# EAGLE board RP2040_MainV1_alternateLayout (EAGLE 9.6.2)
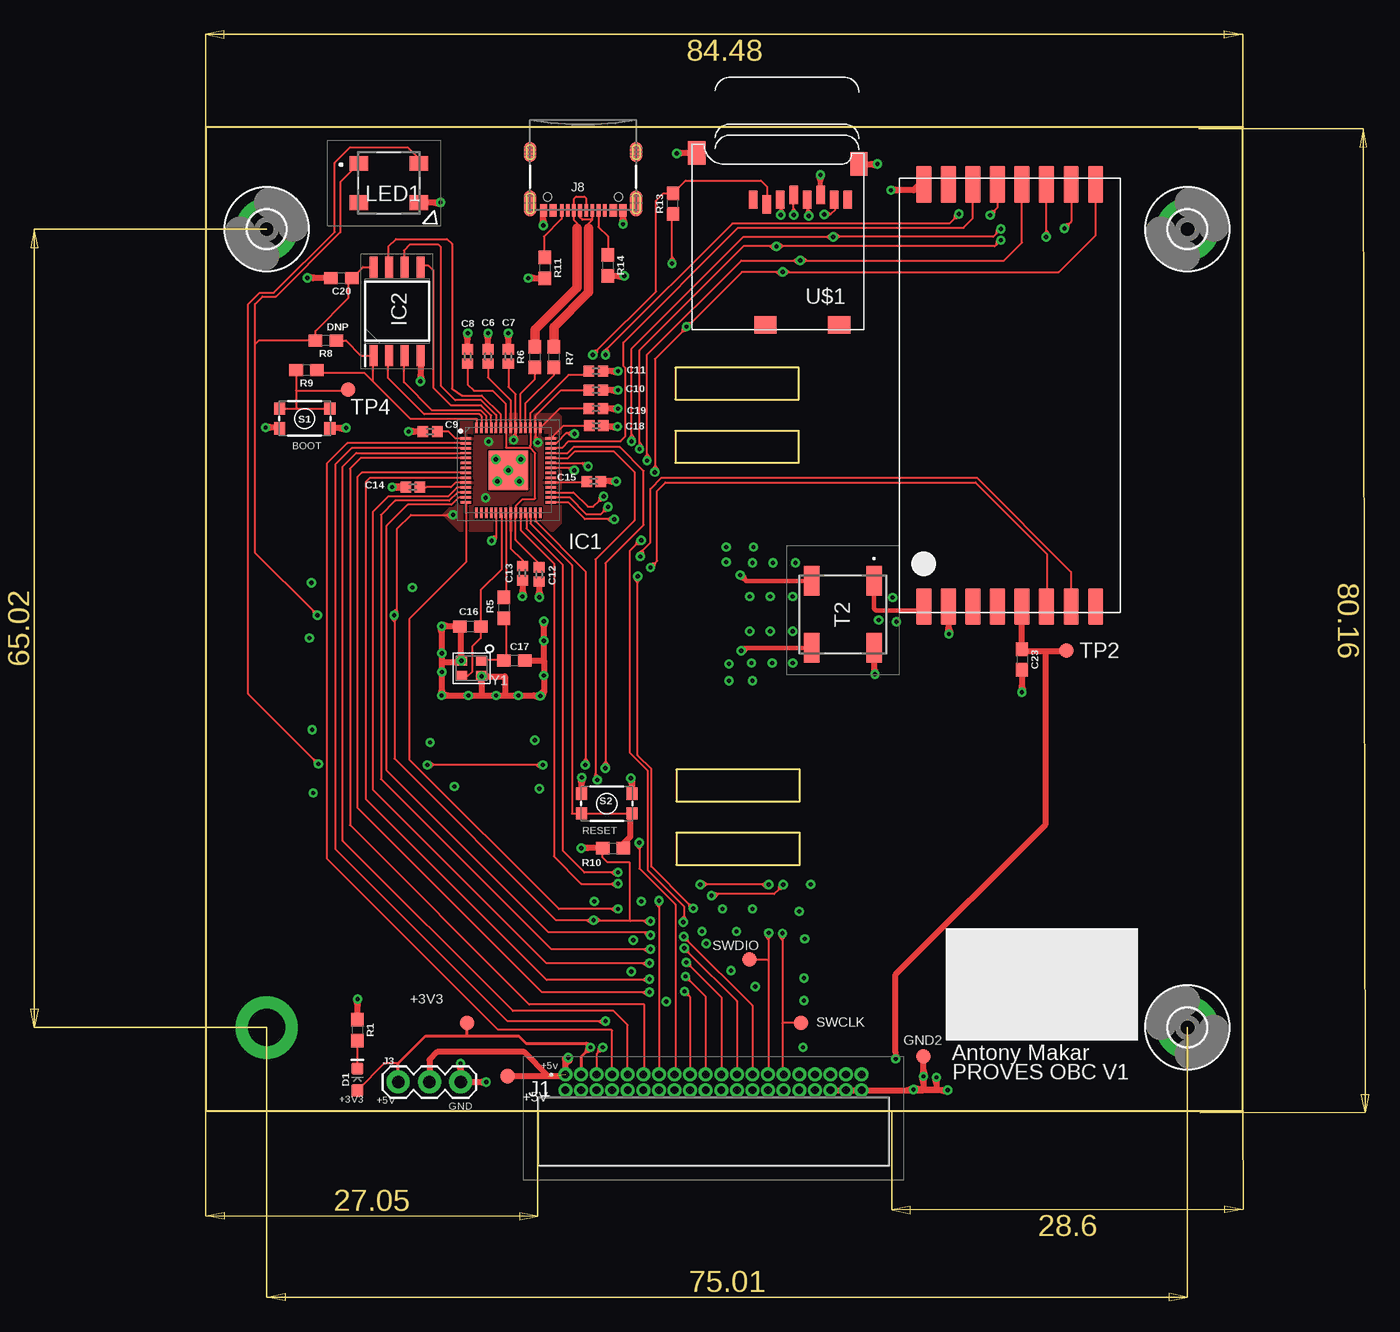
[diagram p3: board, top side]
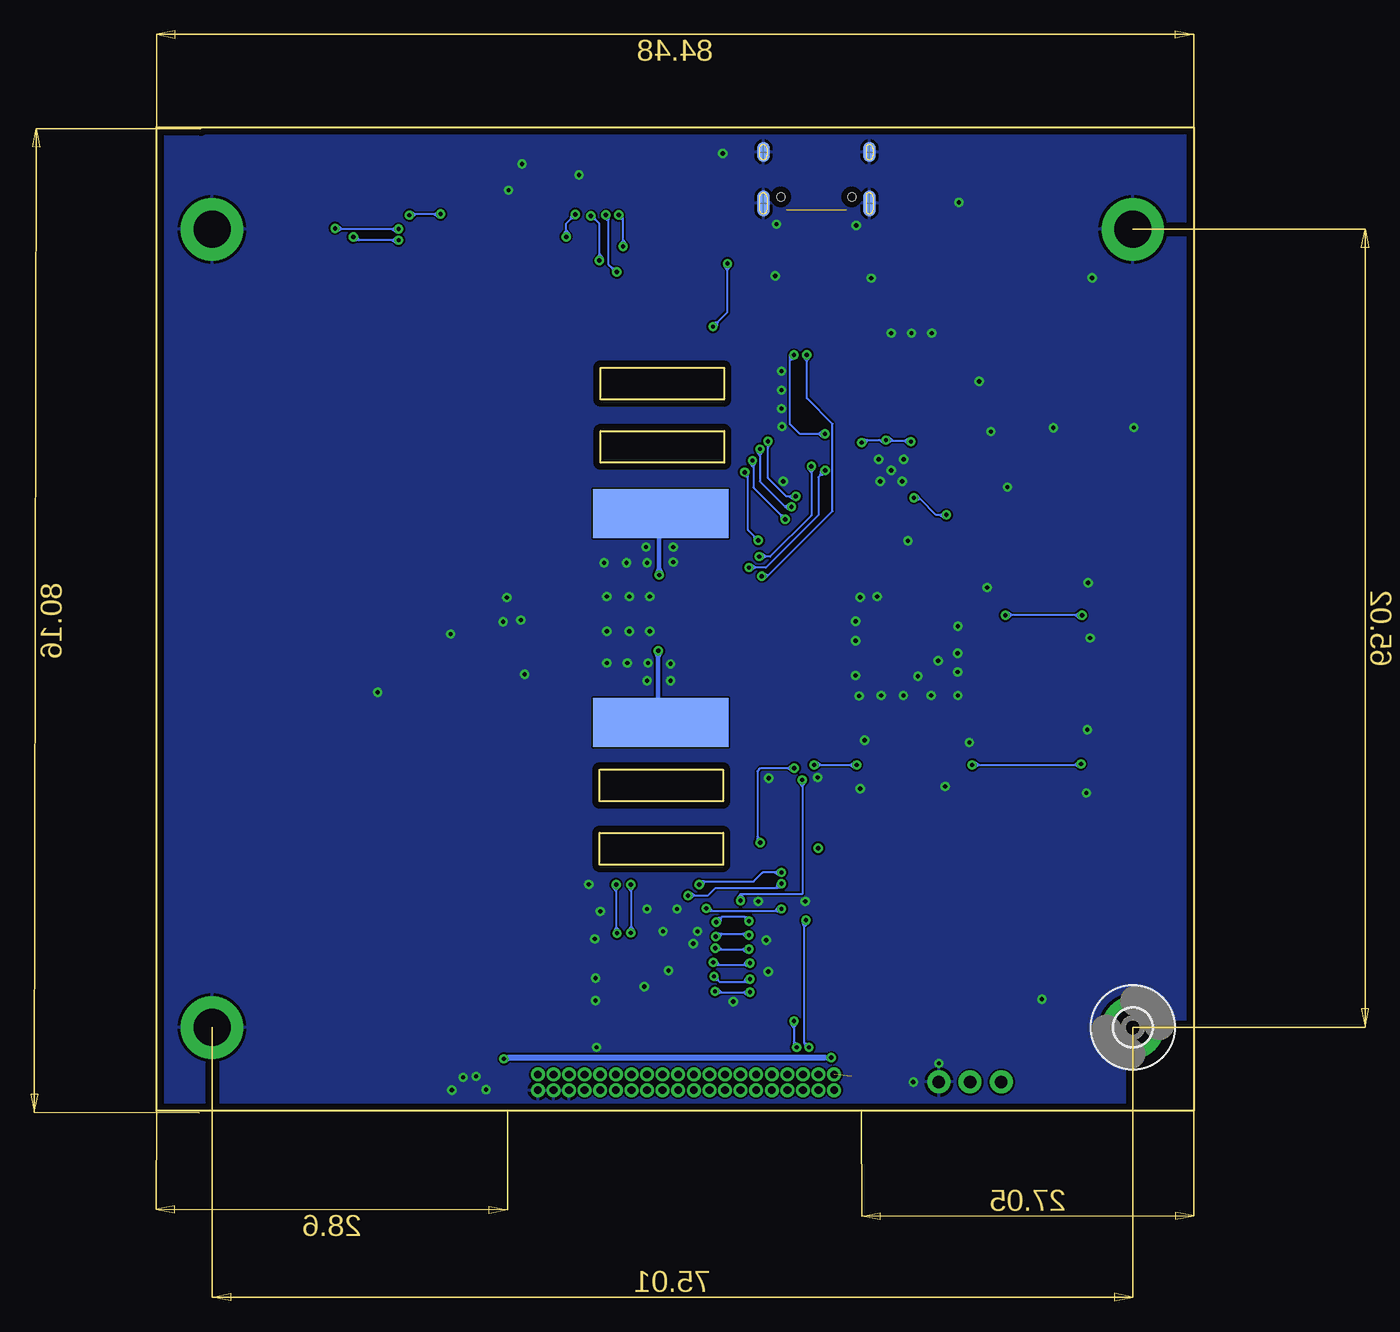
[diagram p4: board, bottom side, seen from below]

Size 84.48 x 80.16 mm. Coordinates in mm from the lower left corner, seen from the top.
Outline: 0,80.16 0,0 84.48,0 84.48,80.16 0,80.16
Outline: 38.25,55.4 38.25,52.81 48.31,52.81 48.31,55.4 38.25,55.4
Outline: 38.25,60.55 38.25,57.96 48.31,57.96 48.31,60.55 38.25,60.55
Outline: 38.33,22.66 38.33,20.07 48.39,20.07 48.39,22.66 38.33,22.66
Outline: 38.33,27.81 38.33,25.22 48.39,25.22 48.39,27.81 38.33,27.81
Copper layers (1*16): Top 0.035mm / dielectric 1.5mm / Bottom 0.035mm
Design rules "default *": minimum track width 6mil, minimum drill 0.35mm, track to track 6mil, track to pad 6mil, pad to pad 6mil, via to via 6mil, smd to smd 6mil, copper to edge 20mil, drill to drill 6mil, minimum pad ring 10mil, minimum via ring 8mil, stop-mask expansion 2mil, vias tented up to drill 40mil, thermal gap 10mil

## Footprints (pad centres in the part's own frame; a part is rotated, then mirrored left to right if it is on the bottom)
TP12R = smd 1.2 x 1.2: TP 0,0
0402 = smd 0.85 x 0.9: 1 -0.58,0; 2 0.58,0
0603 = smd 1.1 x 1: 1 -0.85,0; 2 0.85,0
LED-0603 = smd 1 x 1: A -0.877,0; C 0.877,0
3,0-PAD = drill 3 pad 5.08: B3,0 0,0
QFN40P700X700X90-57N = smd 0.85 x 0.2: 1 -3.45,2.6; 2 -3.45,2.2; 3 -3.45,1.8; 4 -3.45,1.4; 5 -3.45,1; 6 -3.45,0.6; 7 -3.45,0.2; 8 -3.45,-0.2; 9 -3.45,-0.6; 10 -3.45,-1; 11 -3.45,-1.4; 12 -3.45,-1.8; 13 -3.45,-2.2; 14 -3.45,-2.6; 29 3.45,-2.6; 30 3.45,-2.2; 31 3.45,-1.8; 32 3.45,-1.4; 33 3.45,-1; 34 3.45,-0.6; 35 3.45,-0.2; 36 3.45,0.2; 37 3.45,0.6; 38 3.45,1; 39 3.45,1.4; 40 3.45,1.8; 41 3.45,2.2; 42 3.45,2.6 | smd 0.2 x 0.85: 15 -2.6,-3.45; 16 -2.2,-3.45; 17 -1.8,-3.45; 18 -1.4,-3.45; 19 -1,-3.45; 20 -0.6,-3.45; 21 -0.2,-3.45; 22 0.2,-3.45; 23 0.6,-3.45; 24 1,-3.45; 25 1.4,-3.45; 26 1.8,-3.45; 27 2.2,-3.45; 28 2.6,-3.45; 43 2.6,3.45; 44 2.2,3.45; 45 1.8,3.45; 46 1.4,3.45; 47 1,3.45; 48 0.6,3.45; 49 0.2,3.45; 50 -0.2,3.45; 51 -0.6,3.45; 52 -1,3.45; 53 -1.4,3.45; 54 -1.8,3.45; 55 -2.2,3.45; 56 -2.6,3.45 | smd 3.2 x 3.2: 57 0,0
SOIC127P790X216-8N = smd 1.7 x 0.65: 1 -3.6,1.905; 2 -3.6,0.635; 3 -3.6,-0.635; 4 -3.6,-1.905; 5 3.6,-1.905; 6 3.6,-0.635; 7 3.6,0.635; 8 3.6,1.905
TFM-120-01-XXX-D-RA = drill 0.635 pad 1: 1 0,0; 2 0,1.27; 3 -1.27,0; 4 -1.27,1.27; 5 -2.54,0; 6 -2.54,1.27; 7 -3.81,0; 8 -3.81,1.27; 9 -5.08,0; 10 -5.08,1.27; 11 -6.35,0; 12 -6.35,1.27; 13 -7.62,0; 14 -7.62,1.27; 15 -8.89,0; 16 -8.89,1.27; 17 -10.16,0; 18 -10.16,1.27; 19 -11.43,0; 20 -11.43,1.27; 21 -12.7,0; 22 -12.7,1.27; 23 -13.97,0; 24 -13.97,1.27; 25 -15.24,0; 26 -15.24,1.27; 27 -16.51,0; 28 -16.51,1.27; 29 -17.78,0; 30 -17.78,1.27; 31 -19.05,0; 32 -19.05,1.27; 33 -20.32,0; 34 -20.32,1.27; 35 -21.59,0; 36 -21.59,1.27; 37 -22.86,0; 38 -22.86,1.27; 39 -24.13,0; 40 -24.13,1.27
1X03 = drill 1.016 pad 1.88: 1 0,0; 2 2.54,0; 3 5.08,0
USB-C-16P-4LAYER-ISOLATED = smd 0.3 x 1: A5 -1.25,-0.34; A6 -0.25,-0.34; A7 0.25,-0.34; A8 1.25,-0.34; B5 1.75,-0.34; B6 0.75,-0.34; B7 -0.75,-0.34; B8 -1.75,-0.34 | smd 0.6 x 1: GND -3.225,-0.34; GND2 3.225,-0.34; VBUS1 -2.45,-0.34; VBUS2 2.45,-0.34 | smd 1 x 2.1: SHLD1 -4.32,-0.915; SHLD2 4.32,-0.915 | smd 1 x 2.1 bottom: SHLD3 -4.32,-0.915; SHLD4 4.32,-0.915 | smd 1 x 1.6: SHLD5 -4.32,-5.095; SHLD8 4.32,-5.095 | smd 1 x 1.6 bottom: SHLD6 -4.32,-5.095; SHLD7 4.32,-5.095 | hole 0.65: -2.89,-1.445; 2.89,-1.445
ILPHK501RGBWSK68120501 = smd 1.5 x 1.2: 1 -2.45,1.6; 2 2.45,1.6; 3 2.45,-1.6; 4 -2.45,-1.6
TACTILE_SWITCH_SMD_4.6X2.8MM = smd 0.9 x 1: 1 -2.05,-0.8; 2 2.05,-0.8; 3 2.05,0.8; 4 -2.05,0.8
MABA010441CT38A0 = smd 1.27 x 2.4: 1 -2.54,-2.725; 2 2.54,-2.725; 3 2.54,2.725; 4 -2.54,2.725
MICROSD = smd 0.7 x 1.5: 1 9,-10.64; 2 7.9,-10.24; 3 6.8,-10.64; 4 5.7,-11.04; 5 4.6,-10.64; 6 3.5,-11.04; 7 2.4,-10.64; 8 1.3,-10.64 | smd 1.8 x 1.4: CD1 2,-0.44; CD2 8,-0.44 | smd 1.4 x 1.9: MT1 0.4,-13.54; MT2 13.6,-14.44
RFM95PW = smd 3 x 1.25: 3V3 17.2,-7; ANT -17.2,7; DIO0 -17.2,-3; DIO1 -17.2,-5; DIO2 -17.2,-7; DIO3 -17.2,3; DIO4 -17.2,1; DIO5 17.2,5; GND@0 -17.2,5; GND@1 17.2,7; MISO 17.2,-5; MOSI 17.2,-3; NSS 17.2,1; RST 17.2,3; SCK 17.2,-1; VCC -17.2,-1
BIGPADS = smd 3.988 x 10.998: P$1 -15.24,-2.54; P$2 1.778,-2.54
CRYSTAL_2.5X2 = smd 0.9 x 0.8: 1 -0.825,-0.625; 2 0.825,-0.625; 3 0.825,0.625; 4 -0.825,0.625

## Placement (x,y rotation side)
+3V3TP  TPTP12R  [TP12R]  21.29,7.19 0 top
+5VTP  TPTP12R  [TP12R]  24.59,2.84 0 top
C6  100nF  [0402]  22.99,61.47 90 top
C7  100nF  [0402]  24.64,61.47 90 top
C8  100nF  [0402]  21.34,61.47 90 top
C9  100nF  [0402]  18.26,55.35 180 top
C10  1uF  [0402]  31.78,58.72 0 top
C11  1uF  [0402]  31.78,60.27 0 top
C12  100nF  [0402]  27.15,43.71 90 top
C13  100nF  [0402]  25.78,43.81 90 top
C14  100nF  [0402]  16.87,50.83 180 top
C15  100nF  [0402]  31.6,51.28 0 top
C16  20pF  [0603]  21.54,39.47 0 top
C17  20pF  [0603]  25.12,36.7 180 top
C18  100nF  [0402]  31.8,55.83 180 top
C19  100nF  [0402]  31.78,57.23 180 top
C20  100nF  [0603]  11.05,67.84 180 top
C23  10uF  [0603]  66.47,36.78 270 top
D1  Green  [LED-0603]  12.34,2.57 90 top
GND2  TPTP12R  [TP12R]  58.45,4.47 0 top
H1  MOUNT-PAD-ROUND3.0  [3,0-PAD]  4.95,6.81 0 bottom
H2  MOUNT-PAD-ROUND3.0  [3,0-PAD]  4.95,71.83 0 top
H3  MOUNT-PAD-ROUND3.0  [3,0-PAD]  79.96,6.81 90 top
H4  MOUNT-PAD-ROUND3.0  [3,0-PAD]  79.96,71.83 0 top
IC1  RP2040  [QFN40P700X700X90-57N]  24.64,52.2 0 top
IC2  GD25Q64CSIGR  [SOIC127P790X216-8N]  15.57,65.15 90 top
J1  TFM-120-01-L-D-RA  [TFM-120-01-XXX-D-RA]  29.29,2.97 180 top
J3  455-1750-1-ND  [1X03]  15.67,2.36 0 top
J8  USB Female Type C Connector  [USB-C-16P-4LAYER-ISOLATED]  30.73,73.02 180 top
LED1  ILPH-K501-RGBW-SK6812-05-01  [ILPHK501RGBWSK68120501]  14.91,75.59 0 top
R1  1k  [0603]  12.34,6.6 270 top
R5  1k  [0603]  24.28,41 270 top
R6  27  [0603]  26.8,61.42 270 top
R7  27  [0603]  28.35,61.42 270 top
R8  DNP  [0603]  9.78,62.76 180 top
R9  1k  [0603]  8.2,60.35 180 top
R10  10k  [0603]  33.17,21.41 0 top
R11  5.1k  [0603]  27.61,68.68 270 top
R13  10k  [0603]  38.05,73.91 90 top
R14  5.1k  [0603]  32.74,68.88 270 top
S1  MOMENTARY-SWITCH-SPST-SMD-4.6X2.8MM  [TACTILE_SWITCH_SMD_4.6X2.8MM]  8.05,56.41 180 top
S2  MOMENTARY-SWITCH-SPST-SMD-4.6X2.8MM  [TACTILE_SWITCH_SMD_4.6X2.8MM]  32.66,25.04 0 top
SWCLK  TPTP12R  [TP12R]  48.49,7.16 0 top
SWDIO  TPTP12R  [TP12R]  44.3,12.34 0 top
T2  MABA-010441-CT38A0  [MABA010441CT38A0]  51.89,40.46 180 top
TP2  TPTP12R  [TP12R]  70.1,37.52 0 top
TP4  TPTP12R  [TP12R]  11.61,58.75 0 top
U$1  MICROSD  [MICROSD]  53.59,63.6 180 top
U$2  RFM95W  [RFM95PW]  65.48,58.29 90 top
U$4  BIGPAD  [BIGPADS]  45.95,46.89 90 bottom
Y1  [CRYSTAL_2.5X2]  21.64,36.07 180 top

## Tracks (layer width: path | path; a pad name or v marks a point on that pad's centre or on a via)
+1V1
  Top 0.152: C11.1 30.89,59.97 29.54,59.97 26.44,56.87 IC1.45 26.44,54.23 26.39,54.18 26.39,54.05 | C12.2 27.15,44.6 25.24,46.52 IC1.23 25.23,49.27 25.8,49.84 26.75,49.84 26.82,49.91 26.82,53.59 26.39,54.03 26.39,54.05 | C8.1 21.34,59.18 21.84,58.67 23.37,58.67 24.43,57.61 IC1.50 24.44,54.07 24.46,54.05 26.39,54.05
+3V3  (via drill 0.35)
  Top 0.152: IC1.49 24.84,57.91 22.99,59.76 C6.1 | C7.1 24.64,58.98 25.24,58.38 IC1.48 25.24,55.16 | IC1.22 24.84,45.82 25.78,44.88 C13.2 | IC1.1 20.33,54.8 19.78,55.35 C9.1 | C15.1 31.01,51.25 30.96,51.2 IC1.33 | C18.2 31.2,55.81 29.1,55.81 IC1.42 | C10.1 28.93,58.73 26.84,56.63 IC1.44 26.84,55.27 26.84,55.26 26.84,54.94 | C19.2 28.82,57.23 IC1.43 | R8.2 8.93,62.79 | 8.93,62.79 8.93,63.55 11.6,66.22 11.6,67.55 C20.1 12.81,68.75 IC2.8 | IC1.10 20.35,51.2 19.97,50.82 17.97,50.82 17.97,50.83 C14.1 | J1.3 30.58,3 | v31.57,15.55 31.05,15.55 | 31.05,15.55 28.52,15.55 15.37,28.7 15.37,39.86 | v15.34,40.39 15.37,40.39 15.37,39.86 | 15.54,40.87 15.54,47.4 16.71,48.56 19.62,48.56 | 15.54,40.87 15.54,40.59 v15.34,40.39 | 19.62,48.56 v20.14,48.56 | 8.72,40.76 4.01,45.47 4.01,62.46 | 8.72,40.76 v9.09,40.39 | v31.57,15.55 32.1,15.55 | 32.1,15.55 34.51,15.55 | R10.1 32.32,20.65 32.7,20.27 34.51,20.27 34.51,15.55 | v38.89,15.39 38.96,15.47 38.96,15.91 | 38.96,15.91 38.96,16.66 35.99,19.63 35.99,27.74 34.54,29.18 34.54,45.65 35.05,46.15 | 25.24,55.16 25.24,55 25.07,54.84 v25.07,54.66 | v36.22,15.47 35.69,15.47 | 35.69,15.47 34.58,15.47 34.51,15.55 | 26.84,54.94 26.84,54.66 v27.04,54.46 | D1.A 14.57,3.91 15.7,3.91 | 35.05,46.15 35.38,46.48 v35.46,46.48 | v46.99,68.35 46.46,68.35 | 46.46,68.35 43.66,68.35 39.55,64.24 | 39.55,64.24 39.29,63.98 | 39.29,63.98 38.81,63.5 | 38.81,63.5 36.58,61.26 36.58,52.57 | 36.58,52.57 v36.58,52.04 | v46.99,68.35 47.51,68.35 | 47.51,68.35 69.47,68.35 72.48,71.36 U$2.3V3 | v37.97,69.04 37.97,69.56 | 37.97,69.56 37.97,72.99 R13.1 | v47.88,72.99 47.88,73.51 | 47.88,73.51 47.88,74.63 U$1.4 | 4.01,62.46 4.34,62.79 8.93,62.79
  Top 0.152: 4.01,62.46 4.01,65.73 4.62,66.34 5.71,66.34 10.95,71.58 10.95,75.68 LED1.1 12.46,76.87 | 39.29,63.98 39.24,63.98 v39.15,63.9 | 31.05,15.55 31.4,15.3 v31.57,15.55 | 31.05,15.55 31.4,15.79 v31.57,15.55 | 32.1,15.55 31.75,15.79 v31.57,15.55 | 32.1,15.55 31.75,15.3 v31.57,15.55 | 8.72,40.76 8.8,40.33 v9.09,40.39 | 8.72,40.76 9.14,40.68 v9.09,40.39 | 35.69,15.47 36.05,15.22 v36.22,15.47 | 35.69,15.47 36.05,15.72 v36.22,15.47 | 38.96,15.91 38.67,15.6 v38.89,15.39 | 38.96,15.91 39.16,15.53 v38.89,15.39 | 15.37,39.86 15.6,40.22 v15.34,40.39 | 15.37,39.86 15.1,40.2 v15.34,40.39 | 15.54,40.87 15.18,40.64 v15.34,40.39 | 15.54,40.87 15.64,40.45 v15.34,40.39 | 19.62,48.56 19.97,48.32 v20.14,48.56 | 19.62,48.56 19.97,48.81 v20.14,48.56 | 25.24,55.16 24.89,54.9 v25.07,54.66 | 25.24,55.16 25.35,54.76 25.21,54.72 25.15,54.66 v25.07,54.66 | 26.84,54.94 26.75,54.52 v27.04,54.46 | 26.84,54.94 27.2,54.71 v27.04,54.46 | 35.05,46.15 35.48,46.18 v35.46,46.48 | 35.05,46.15 35.17,46.57 v35.46,46.48 | 36.58,52.57 36.33,52.22 v36.58,52.04 | 36.58,52.57 36.82,52.22 v36.58,52.04 | 37.97,69.56 37.73,69.21 v37.97,69.04 | 37.97,69.56 38.22,69.21 v37.97,69.04 | 46.46,68.35 46.82,68.1 v46.99,68.35 | 46.46,68.35 46.82,68.6 v46.99,68.35 | 47.51,68.35 47.16,68.6 v46.99,68.35 | 47.51,68.35 47.16,68.1 v46.99,68.35 | 47.88,73.51 47.63,73.16 v47.88,72.99 | 47.88,73.51 48.13,73.16 v47.88,72.99 | 39.55,64.24 39.12,64.2 v39.15,63.9 | 39.55,64.24 39.44,63.82 v39.15,63.9 | 38.81,63.5 39.23,63.6 v39.15,63.9 | 38.81,63.5 38.85,63.92 v39.15,63.9
  Top 0.254: 30.58,3 30.58,4.42 30.97,4.81 | 30.97,4.81 v31.34,5.18 | 30.97,5.55 v31.34,5.18 | J3.1 15.67,3.89 15.7,3.91 17.91,6.12 21.36,6.12 | 31.11,5.51 26.09,5.51 25.48,6.12 21.36,6.12 | 21.36,6.12 21.28,6.2 +3V3TP.TP | 30.97,4.81 31.41,4.94 v31.34,5.18 | 30.97,4.81 31.1,5.25 v31.34,5.18 | 30.97,5.55 31.1,5.11 v31.34,5.18 | 30.97,5.55 31.11,5.51 | 31.11,5.51 31.41,5.42 v31.34,5.18
  Top 0.508: R10.1 31.11,21.41 | 31.11,21.41 v30.58,21.41 | 31.11,21.41 30.61,21.53 v30.58,21.41 | 31.11,21.41 30.61,21.29 v30.58,21.41
  Bottom 0.152: 31.72,15.04 31.72,15.39 v31.57,15.55 | 31.72,15.04 31.72,5.56 31.71,5.55 | v31.34,5.18 31.71,5.55 | v36.22,15.47 36.59,15.84 | 36.59,15.84 36.6,15.85 38.43,15.85 38.52,15.76 | 38.52,15.76 v38.89,15.39 | v9.09,40.39 9.62,40.39 | 9.62,40.39 14.82,40.39 | 14.82,40.39 v15.34,40.39 | 22.27,49.83 22.4,49.96 v22.78,49.96 | 22.27,49.83 21.01,48.56 20.67,48.56 | v20.14,48.56 20.67,48.56 | v25.07,54.66 25.02,54.61 24.55,54.61 | 24.55,54.61 23.56,54.61 | 23.56,54.61 23.11,54.61 v23.04,54.53 | v27.04,54.46 26.84,54.66 26.56,54.66 | 26.56,54.66 25.59,54.66 | 25.59,54.66 25.41,54.66 | 25.41,54.66 v25.07,54.66 | v36.58,52.04 36.32,52.04 36.32,51.58 | v35.46,46.48 35.83,46.85 | 35.83,46.85 36.32,47.34 36.32,51.58 | v46.99,68.35 47.06,68.35 47.39,68.69 | 47.39,68.69 47.67,68.96 47.67,72.5 | v47.88,72.99 47.67,72.78 47.67,72.5 | v39.15,63.9 38.78,64.27 | 38.78,64.27 37.97,65.08 37.97,68.51 | 37.97,68.51 v37.97,69.04 | 31.71,5.55 31.29,5.48 v31.34,5.18 | 31.71,5.55 31.64,5.13 v31.34,5.18 | 31.72,15.04 31.86,15.45 v31.57,15.55 | 31.72,15.04 31.39,15.31 v31.57,15.55 | 9.62,40.39 9.27,40.63 v9.09,40.39 | 9.62,40.39 9.27,40.14 v9.09,40.39 | 36.59,15.84 36.17,15.77 v36.22,15.47 | 36.59,15.84 36.52,15.42 v36.22,15.47 | 38.52,15.76 38.59,15.34 v38.89,15.39 | 38.52,15.76 38.94,15.69 v38.89,15.39 | 14.82,40.39 15.17,40.14 v15.34,40.39 | 14.82,40.39 15.17,40.63 v15.34,40.39 | 20.67,48.56 20.32,48.81 v20.14,48.56 | 20.67,48.56 20.32,48.32 v20.14,48.56 | 22.27,49.83 22.68,49.68 v22.78,49.96 | 22.27,49.83 22.55,50.16 v22.78,49.96 | 24.55,54.61 24.92,54.4 v25.07,54.66 | 24.55,54.61 24.87,54.89 v25.07,54.66 | 25.41,54.66 25.18,54.82 v25.07,54.66
  Bottom 0.152: 25.59,54.66 25.24,54.41 v25.07,54.66 | 23.56,54.61 23.17,54.8 v23.04,54.53 | 23.56,54.61 23.24,54.31 v23.04,54.53 | 26.56,54.66 26.79,54.3 v27.04,54.46 | 26.56,54.66 26.98,54.75 v27.04,54.46 | 35.83,46.85 35.41,46.78 v35.46,46.48 | 35.83,46.85 35.76,46.43 v35.46,46.48 | 36.32,51.58 36.71,51.77 v36.58,52.04 | 36.32,51.58 36.28,52.01 v36.58,52.04 | 37.97,68.51 38.22,68.86 v37.97,69.04 | 37.97,68.51 37.73,68.86 v37.97,69.04 | 47.39,68.69 46.97,68.65 v46.99,68.35 | 47.39,68.69 47.28,68.27 v46.99,68.35 | 47.67,72.5 48.04,72.73 v47.88,72.99 | 47.67,72.5 47.58,72.92 v47.88,72.99 | 38.78,64.27 38.85,63.84 v39.15,63.9 | 38.78,64.27 39.2,64.19 v39.15,63.9
  pour Top: 20.75,56.77 20.75,50.01 19.33,48.59 20.62,47.29 28.32,47.29 28.93,47.9 28.93,56.57 28.73,56.77
+5V  (via drill 0.35)  (1 unrouted)
  Top 0.152: 68.38,37.39 68.33,37.44 | 66.47,41.08 U$2.VCC
  Top 0.254: 29.29,3.87 29.29,4.12 v29.51,4.34 29.66,4.14 | v56.18,4.24 56.18,4.77 | TP2.TP 70.03,37.44 | 66.66,37.44 C23.1 | 56.18,4.77 55.96,4.36 v56.18,4.24 | 56.18,4.77 56.4,4.36 v56.18,4.24
  Top 0.508: 29.29,3.87 J1.1 29.16,2.85 +5VTP.TP | 56.18,4.77 56.18,11.12 68.38,23.32 68.38,37.39 | 70.03,37.44 68.33,37.44 66.66,37.44 | 27.89,2.85 25.93,4.8 18.85,4.8 18.21,4.17 J3.2 | C23.1 66.47,41.08 | 29.29,3.87 29.66,4.14 | 29.29,3.87 29.26,4.33 v29.51,4.34
  Bottom 0.254: v29.51,4.34 30.04,4.34 | 55.66,4.3 56.13,4.3 v56.18,4.24 | 30.04,4.34 29.63,4.56 v29.51,4.34 | 30.04,4.34 29.63,4.12 v29.51,4.34 | 55.66,4.3 56.04,4.03 v56.18,4.24 | 55.66,4.3 55.78,4.34 | v56.18,4.24 56.09,4.47
  Bottom 0.508: 30.04,4.34 55.78,4.34
A0  (via drill 0.35)
  Top 0.152: IC1.38 29.51,53.2 30.02,53.7 33.26,53.7 34.9,52.07 34.9,48.11 31.72,44.93 31.72,27.48 | 31.72,27.48 31.72,26.98 v31.88,26.98 | v36.91,17.15 36.91,16.62 | 36.91,16.62 J1.13 | 31.72,27.48 31.59,27.07 v31.88,26.98 | 31.72,27.48 32.06,27.21 v31.88,26.98 | 36.91,16.62 37.15,16.97 v36.91,17.15 | 36.91,16.62 36.66,16.97 v36.91,17.15
  Bottom 0.152: v31.88,26.98 31.88,26.45 | 31.88,26.45 31.88,17.68 36.91,17.68 36.91,17.67 | 36.91,17.67 v36.91,17.15 | 31.88,26.45 32.12,26.8 v31.88,26.98 | 31.88,26.45 31.63,26.8 v31.88,26.98 | 36.91,17.67 36.66,17.32 v36.91,17.15 | 36.91,17.67 37.15,17.32 v36.91,17.15
A1  (via drill 0.35)
  Top 0.152: J1.15 38.25,3.05 38.25,16.81 35.31,19.76 35.31,21.34 | v35.31,21.87 35.31,21.34 | 32.54,28.46 32.54,44.63 35.66,47.75 35.66,52.15 33.73,54.08 29.94,54.08 29.43,53.57 28.11,53.57 IC1.39 | 32.54,28.46 v32.54,27.94 v32.53,27.94 | 35.31,21.34 35.55,21.7 v35.31,21.87 | 35.31,21.34 35.06,21.7 v35.31,21.87 | 32.54,28.46 32.29,28.11 v32.53,27.94 | 32.54,28.46 32.78,28.11 v32.53,27.94
  Bottom 0.152: 35.53,22.34 35.53,27.68 35.28,27.94 33.06,27.94 | 35.53,22.34 35.53,22.1 v35.31,21.87 | 33.06,27.94 v32.53,27.94 | 35.53,22.34 35.16,22.13 v35.31,21.87 | 35.53,22.34 35.6,21.92 v35.31,21.87 | 33.06,27.94 32.71,28.18 v32.53,27.94 | 33.06,27.94 32.71,27.69 v32.53,27.94
ANT
  Top 0.2: U$2.ANT 58.15,40.77
  Top 0.368: 58.15,40.77 54.58,40.77 54.43,40.92 T2.1
D4  (via drill 0.35)
  Top 0.152: v36.14,9.68 35.62,9.68 | 35.62,9.68 27.38,9.68 12.37,24.69 12.37,51.66 12.7,52 IC1.8 | v38.99,9.75 39.36,9.38 | 39.36,9.38 39.45,9.3 J1.17 | 39.36,9.38 39.29,9.81 v38.99,9.75 | 39.36,9.38 38.94,9.46 v38.99,9.75 | 35.62,9.68 35.97,9.43 v36.14,9.68 | 35.62,9.68 35.97,9.92 v36.14,9.68
  Bottom 0.152: v38.99,9.75 38.99,9.68 38.47,9.68 | 38.47,9.68 36.67,9.68 | 36.67,9.68 v36.14,9.68 | 38.47,9.68 38.85,9.48 v38.99,9.75 | 38.47,9.68 38.78,9.97 v38.99,9.75 | 36.67,9.68 36.32,9.92 v36.14,9.68 | 36.67,9.68 36.32,9.43 v36.14,9.68
D5  (via drill 0.35)
  Top 0.152: v36.14,10.74 36.14,10.67 35.62,10.67 | 35.62,10.67 27.76,10.67 13.06,25.37 13.06,51.28 13.37,51.6 IC1.9 | v39.06,10.97 39.44,10.6 | 39.44,10.6 40.72,9.32 J1.19 | 39.44,10.6 39.36,11.02 v39.06,10.97 | 39.44,10.6 39.01,10.67 v39.06,10.97 | 35.62,10.67 36.01,10.47 v36.14,10.74 | 35.62,10.67 35.94,10.96 v36.14,10.74
  Bottom 0.152: v39.06,10.97 38.69,10.6 | 38.69,10.6 38.61,10.52 36.62,10.52 | 36.62,10.52 36.37,10.52 v36.14,10.74 | 38.69,10.6 39.12,10.67 v39.06,10.97 | 38.69,10.6 38.77,11.02 v39.06,10.97 | 36.62,10.52 36.41,10.89 v36.14,10.74 | 36.62,10.52 36.19,10.45 v36.14,10.74
D6  (via drill 0.35)
  Top 0.152: IC1.11 20.46,50.8 19.72,50.06 14.85,50.06 13.59,48.79 13.59,26.21 27.76,12.04 35.62,12.04 | v36.14,12.04 35.62,12.04 | v39.14,12.12 39.51,11.74 | 39.51,11.74 41.99,9.27 J1.21 | 35.62,12.04 35.97,11.79 v36.14,12.04 | 35.62,12.04 35.97,12.29 v36.14,12.04 | 39.51,11.74 39.44,12.17 v39.14,12.12 | 39.51,11.74 39.09,11.82 v39.14,12.12
  Bottom 0.152: 38.67,11.89 38.91,11.89 v39.14,12.12 | 38.67,11.89 36.65,11.89 | 36.65,11.89 36.3,11.89 v36.14,12.04 | 36.65,11.89 36.38,12.23 v36.14,12.04 | 36.65,11.89 36.24,11.75 v36.14,12.04 | 38.67,11.89 39.09,11.82 v39.14,12.12 | 38.67,11.89 38.88,12.26 v39.14,12.12
D9  (via drill 0.35)
  Top 0.152: v36.22,13.18 35.7,13.18 | 35.7,13.18 28.15,13.18 14.27,27.05 14.27,48.57 15.42,49.71 19.82,49.71 20.5,50.4 IC1.12 | v38.96,13.26 39.33,12.89 | 39.33,12.89 43.26,8.97 J1.23 | 39.33,12.89 39.26,13.31 v38.96,13.26 | 39.33,12.89 38.91,12.96 v38.96,13.26 | 35.7,13.18 36.05,12.93 v36.22,13.18 | 35.7,13.18 36.05,13.42 v36.22,13.18
  Bottom 0.152: v38.96,13.26 38.96,13.18 38.44,13.18 | 38.44,13.18 36.75,13.18 | 36.75,13.18 v36.22,13.18 | 38.44,13.18 38.83,12.99 v38.96,13.26 | 38.44,13.18 38.75,13.48 v38.96,13.26 | 36.75,13.18 36.4,13.42 v36.22,13.18 | 36.75,13.18 36.4,12.93 v36.22,13.18
D10  (via drill 0.35)
  Top 0.152: v36.22,14.33 35.99,14.55 35.75,14.55 | 35.75,14.55 27.92,14.55 14.73,27.74 14.73,47.68 16.44,49.39 20.01,49.39 20.62,50 IC1.13 | v38.92,14.21 39.29,13.84 | 39.29,13.84 44.53,8.6 J1.25 | 39.29,13.84 39.22,14.26 v38.92,14.21 | 39.29,13.84 38.87,13.91 v38.92,14.21 | 35.75,14.55 35.96,14.18 v36.22,14.33 | 35.75,14.55 36.17,14.62 v36.22,14.33
  Bottom 0.152: 38.45,14.44 38.69,14.44 v38.92,14.21 | 38.45,14.44 36.74,14.44 | 36.74,14.44 36.33,14.44 v36.22,14.33 | 38.45,14.44 38.66,14.06 v38.92,14.21 | 38.45,14.44 38.87,14.5 v38.92,14.21 | 36.74,14.44 36.34,14.6 v36.22,14.33 | 36.74,14.44 36.44,14.12 v36.22,14.33
DIN  (via drill 0.35)
  Top 0.152: IC1.27 26.84,48.04 30.91,43.97 30.91,28.72 | 30.91,28.72 v30.91,28.19 | v27.46,28.19 26.93,28.19 | 26.93,28.19 18.56,28.19 | 18.56,28.19 v18.03,28.19 | v9.17,28.27 8.8,28.64 | 8.8,28.64 3.45,33.98 3.45,65.73 4.37,66.65 5.54,66.65 10.49,71.6 10.49,77.24 11.76,78.51 16.43,78.51 17.36,77.58 LED1.2 | 30.91,28.72 30.66,28.37 v30.91,28.19 | 30.91,28.72 31.16,28.37 v30.91,28.19 | 26.93,28.19 27.28,27.95 v27.46,28.19 | 26.93,28.19 27.28,28.44 v27.46,28.19 | 18.56,28.19 18.21,28.44 v18.03,28.19 | 18.56,28.19 18.21,27.95 v18.03,28.19 | 8.8,28.64 8.87,28.22 v9.17,28.27 | 8.8,28.64 9.22,28.57 v9.17,28.27
  Bottom 0.152: v30.91,28.19 30.39,28.19 | 30.39,28.19 27.98,28.19 | 27.98,28.19 v27.46,28.19 | v18.03,28.19 17.51,28.19 | 17.51,28.19 9.69,28.19 | 9.69,28.19 9.25,28.19 v9.17,28.27 | 30.39,28.19 30.74,27.95 v30.91,28.19 | 30.39,28.19 30.74,28.44 v30.91,28.19 | 27.98,28.19 27.63,28.44 v27.46,28.19 | 27.98,28.19 27.63,27.95 v27.46,28.19 | 17.51,28.19 17.86,27.95 v18.03,28.19 | 17.51,28.19 17.86,28.44 v18.03,28.19 | 9.69,28.19 9.38,28.49 v9.17,28.27 | 9.69,28.19 9.3,28 v9.17,28.27
GND  (via drill 0.35)  (4 unrouted)
  Top 0.152: IC1.19 23.64,46.83 | 23.64,46.83 23.64,46.62 23.47,46.46 v23.27,46.46 | 23.64,46.83 23.21,46.75 v23.27,46.46 | 23.64,46.83 23.56,46.4 v23.27,46.46
  Top 0.406: U$1.6 50.06,74.67 50.06,75.73 | 50.06,75.73 v50.06,76.25 | 50.06,75.73 50.23,76.19 v50.06,76.25 | 50.06,75.73 49.9,76.19 v50.06,76.25
  Top 0.508: C9.2 17.03,55.35 | 17.03,55.35 v16.51,55.35 | v33.58,60.27 33.05,60.27 | 33.05,60.27 C11.2 | v33.58,58.73 33.05,58.73 | 33.05,58.73 C10.2 | v33.58,57.23 33.05,57.23 | 33.05,57.23 C19.1 | C18.1 32.46,55.75 33,55.75 | v33.53,55.75 33,55.75 | C15.2 32.2,51.31 32.9,51.31 | v33.43,51.31 32.9,51.31 | C8.2 21.34,62.85 | 21.34,62.85 v21.34,63.37 | C6.2 22.99,62.85 | 22.99,62.85 v22.99,63.37 | C7.2 24.64,62.85 | 24.64,62.85 v24.64,63.37 | 8.8,67.87 v8.28,67.87 | v19.13,74.02 19.1,73.99 18.6,73.99 | 18.6,73.99 LED1.3 | C13.1 25.78,42.44 | 25.78,42.44 v25.78,41.91 | C12.1 27.15,42.38 | 27.15,42.38 v27.15,41.86 | S2.4 30.61,26.65 | 30.61,26.65 30.61,27.18 v30.63,27.18 | v34.62,27.1 34.71,27.01 34.71,26.59 | 34.71,26.59 S2.3 | S1.3 5.94,55.68 5.4,55.68 | 5.4,55.68 v4.88,55.68 | v11.43,55.65 10.9,55.65 | 10.9,55.65 10.14,55.65 S1.4 | IC2.4 17.47,59.96 | 17.47,59.96 v17.47,59.44 | C23.2 66.47,34.64 | 66.47,34.64 v66.47,34.11 | U$1.MT2 38.88,78.04 | 38.88,78.04 38.39,78.04 v38.35,78 | U$1.MT1 54.19,77.14 | 54.19,77.14 v54.71,77.14 | U$2.GND@1 58.13,75.49 57.64,75.01 56.33,75.01 | 56.33,75.01 v55.8,75.01 | J1.36 J1.40 57.11,1.7 | 58.15,1.7 57.68,1.7 v57.63,1.75 | 58.15,1.7 58.44,1.7 | v57.63,1.75 58.16,1.75 | 58.16,1.75 59.51,1.75 59.51,2.22 | v59.51,2.74 59.51,2.22 | v60.43,1.7 59.9,1.7 | 59.9,1.7 58.44,1.7 | v58.44,2.82 58.44,2.29 | 58.44,2.29 58.44,1.7 | R11.2 26.79,67.84 | v26.26,67.84 26.79,67.84 | v34.09,68.02 33.56,68.02 | 33.56,68.02 32.75,68.02 R14.2 | J8.GND2 27.48,73.34 27.48,72.66 | v27.48,72.14 27.48,72.66 | v33.98,72.24 33.96,72.26 33.96,72.76 | J8.GND 33.96,72.76 | U$2.GND@0 60.48,39.39 | 60.48,39.39 60.48,39.14 60.53,39.09 v60.53,38.86 | v19.2,39.5 19.2,38.97 | 19.2,38.97 19.2,36.55
  Top 0.508: 19.2,36.55 19.2,34.38 | 19.2,34.38 v19.2,33.86 | v19.2,33.86 19.73,33.86 | 19.73,33.86 22.45,33.86 | 22.45,33.86 24.33,33.86 | 24.33,33.86 26.73,33.86 | 26.73,33.86 27.2,33.86 v27.25,33.81 | 27.53,36.7 27.53,34.25 | 27.53,34.25 27.53,34.09 v27.25,33.81 | 27.53,36.7 27.53,39.38 | 27.53,39.38 v27.53,39.9 | C17.1 27.53,36.7 | 19.73,39.47 C16.1 20.8,39.36 20.8,37.2 | 19.73,39.47 19.23,39.47 v19.2,39.5 | v20.8,36.68 20.68,36.55 20.29,36.55 | 20.29,36.55 19.2,36.55 | v22.45,35.41 22.45,34.88 | 22.45,34.88 22.45,33.86 | v20.8,36.68 20.8,37.2 | v22.45,35.41 22.98,35.41 | 22.98,35.41 24.33,35.41 24.36,35.38 24.36,33.88 24.33,33.86 | v20.75,3.89 20.75,3.36 | 20.75,3.36 J3.3 22.31,2.36 | 22.31,2.36 v22.83,2.36 | R1.1 12.37,7.48 12.37,8.59 | 12.37,8.59 v12.37,9.12 | v57.63,1.75 57.58,1.7 57.11,1.7 | v58.44,2.82 58.44,3.34 | 58.44,3.34 GND2.TP | T2.4 54.43,36.11 | 54.43,36.11 54.43,35.66 v54.51,35.59 | 17.03,55.35 16.54,55.47 v16.51,55.35 | 17.03,55.35 16.54,55.23 v16.51,55.35 | 32.9,51.31 33.4,51.19 v33.43,51.31 | 32.9,51.31 33.4,51.43 v33.43,51.31 | 33,55.75 33.5,55.63 v33.53,55.75 | 33,55.75 33.5,55.87 v33.53,55.75 | 33.05,57.23 33.55,57.11 v33.58,57.23 | 33.05,57.23 33.55,57.35 v33.58,57.23 | 33.05,58.73 33.55,58.6 v33.58,58.73 | 33.05,58.73 33.55,58.84 v33.58,58.73 | 33.05,60.27 33.55,60.15 v33.58,60.27 | 33.05,60.27 33.55,60.4 v33.58,60.27 | 21.34,62.85 21.46,63.34 v21.34,63.37 | 21.34,62.85 21.21,63.34 v21.34,63.37 | 22.99,62.85 23.11,63.34 v22.99,63.37 | 22.99,62.85 22.87,63.34 v22.99,63.37 | 24.64,62.85 24.76,63.34 v24.64,63.37 | 24.64,62.85 24.52,63.34 v24.64,63.37 | v8.28,67.87 10.03,67.87 10.16,67.74 10.16,67.8 C20.2 | 8.8,67.87 8.31,67.99 v8.28,67.87
  Top 0.508: 8.8,67.87 8.71,67.84 8.7,67.87 v8.28,67.87 | 25.78,42.44 25.66,41.94 v25.78,41.91 | 25.78,42.44 25.9,41.94 v25.78,41.91 | 27.15,42.38 27.03,41.89 v27.15,41.86 | 27.15,42.38 27.27,41.89 v27.15,41.86 | 18.6,73.99 19.1,73.89 v19.13,74.02 | 18.6,73.99 19.09,74.14 v19.13,74.02 | 30.61,26.65 30.75,27.14 v30.63,27.18 | 30.61,26.65 30.51,27.15 v30.63,27.18 | 34.71,26.59 34.74,27.09 v34.62,27.1 | 34.71,26.59 34.51,27.05 v34.62,27.1 | 10.9,55.65 11.4,55.53 v11.43,55.65 | 10.9,55.65 11.4,55.77 v11.43,55.65 | 5.4,55.68 4.91,55.8 v4.88,55.68 | 5.4,55.68 4.91,55.56 v4.88,55.68 | 19.2,34.38 19.08,33.89 v19.2,33.86 | 19.2,34.38 19.32,33.89 v19.2,33.86 | 19.73,33.86 19.23,33.98 v19.2,33.86 | 19.73,33.86 19.23,33.74 v19.2,33.86 | 19.2,38.97 19.32,39.47 v19.2,39.5 | 19.2,38.97 19.08,39.47 v19.2,39.5 | 19.73,39.47 19.24,39.62 v19.2,39.5 | 19.73,39.47 19.23,39.38 v19.2,39.5 | 27.53,39.38 27.65,39.87 v27.53,39.9 | 27.53,39.38 27.41,39.87 v27.53,39.9 | 17.47,59.96 17.35,59.47 v17.47,59.44 | 17.47,59.96 17.6,59.47 v17.47,59.44 | 66.47,34.64 66.35,34.14 v66.47,34.11 | 66.47,34.64 66.59,34.14 v66.47,34.11 | 54.19,77.14 54.68,77.02 v54.71,77.14 | 54.19,77.14 54.68,77.26 v54.71,77.14 | 38.88,78.04 38.38,78.13 v38.35,78 | 38.88,78.04 38.39,77.89 v38.35,78 | 56.33,75.01 55.83,75.13 v55.8,75.01 | 56.33,75.01 55.83,74.89 v55.8,75.01 | 58.15,1.7 57.67,1.87 v57.63,1.75 | 58.15,1.7 57.65,1.63 v57.63,1.75 | 58.16,1.75 57.66,1.87 v57.63,1.75 | 58.16,1.75 57.66,1.63 v57.63,1.75 | 57.11,1.7 57.61,1.63 v57.63,1.75 | 57.11,1.7 57.59,1.87 v57.63,1.75 | 59.9,1.7 60.4,1.58 v60.43,1.7 | 59.9,1.7 60.4,1.82 v60.43,1.7 | 59.51,2.22 59.63,2.71 v59.51,2.74
  Top 0.508: 59.51,2.22 59.39,2.71 v59.51,2.74 | 58.44,2.29 58.57,2.79 v58.44,2.82 | 58.44,2.29 58.32,2.79 v58.44,2.82 | 58.44,3.34 58.32,2.85 v58.44,2.82 | 58.44,3.34 58.57,2.85 v58.44,2.82 | 26.79,67.84 26.29,67.96 v26.26,67.84 | 26.79,67.84 26.29,67.72 v26.26,67.84 | 33.56,68.02 34.06,67.9 v34.09,68.02 | 33.56,68.02 34.06,68.14 v34.09,68.02 | 27.48,72.66 27.36,72.17 v27.48,72.14 | 27.48,72.66 27.6,72.17 v27.48,72.14 | 33.96,72.76 33.86,72.26 v33.98,72.24 | 33.96,72.76 34.1,72.27 v33.98,72.24 | 60.48,39.39 60.4,38.88 v60.53,38.86 | 60.48,39.39 60.65,38.9 v60.53,38.86 | 26.73,33.86 27.21,33.69 v27.25,33.81 | 26.73,33.86 27.24,33.93 v27.25,33.81 | 27.53,34.25 27.17,33.9 v27.25,33.81 | 27.53,34.25 27.37,33.77 v27.25,33.81 | 20.29,36.55 20.8,36.55 v20.8,36.68 | 20.29,36.55 20.74,36.79 v20.8,36.68 | 20.8,37.2 20.68,36.71 v20.8,36.68 | 20.8,37.2 20.92,36.71 v20.8,36.68 | 22.45,34.88 22.57,35.38 v22.45,35.41 | 22.45,34.88 22.33,35.38 v22.45,35.41 | 22.98,35.41 22.48,35.53 v22.45,35.41 | 22.98,35.41 22.48,35.29 v22.45,35.41 | 22.31,2.36 22.8,2.24 v22.83,2.36 | 22.31,2.36 22.8,2.48 v22.83,2.36 | 20.75,3.36 20.87,3.86 v20.75,3.89 | 20.75,3.36 20.63,3.86 v20.75,3.89 | 12.37,8.59 12.49,9.09 v12.37,9.12 | 12.37,8.59 12.25,9.09 v12.37,9.12 | 54.43,36.11 54.38,35.6 v54.51,35.59 | 54.43,36.11 54.62,35.63 v54.51,35.59
  Top 0.61: C14.2 v15.16,50.83
  other vias: 23.62,53.09 25.65,53.09 23.75,51.31 25.53,51.31 24.64,52.2 23.65,33.86 27.53,35.48 25.45,33.86 27.53,38.3 21.39,33.86 19.23,35.76 19.23,37.29 42.09,16.46 40.41,14.63 31.65,17.07 44.75,10.13 48.79,14.02 48.64,5.18 48.72,10.82 42.77,11.43 48.72,8.99 34.65,11.35 40.77,13.64 34.82,13.92 48.34,16.26 44.53,16.46 43.23,14.63 49.28,18.47 35.46,17.07 37.52,8.92 18.26,30.02 8.66,31.06 8.74,25.91 20.24,26.44 26.8,30.2 27.15,26.26 8.43,38.53 8.59,43.03 16.81,42.65 54.81,40 56.26,39.85 55.96,41.83 44.3,39.09 45.97,39.09 47.8,39.09 44.45,36.5 46.13,36.5 47.8,36.5 44.53,44.65 46.2,44.65 48.03,44.65 44.3,41.91 45.97,41.91 47.8,41.91 42.39,44.73 42.39,45.95 44.6,45.95 44.53,35.05 42.62,35.05 42.62,36.42
  pour Bottom: 2.21,89.33 -3.38,83.74 -3.38,-4.85 89.13,-4.85 90.65,-3.33 90.65,82.45 84.2,88.9 2.62,88.9 2.21,89.31
N$1
  Top 0.152: R5.2 24.43,39.99 24.43,36.87 C17.2 24.22,36.75 22.59,36.75 22.52,36.68 22.48,36.68 Y1.1
N$2  (via drill 0.35)
  Top 0.368: T2.2 44.01,43.19 43.91,43.29 | 43.91,43.29 v43.54,43.66 | 43.91,43.29 43.71,43.74 v43.54,43.66 | 43.91,43.29 43.46,43.48 v43.54,43.66
  Bottom 0.368: v43.54,43.66 43.54,44.19 | 43.54,44.19 43.54,48.54 U$4.P$2 | 43.54,44.19 43.35,43.73 v43.54,43.66 | 43.54,44.19 43.72,43.73 v43.54,43.66
N$3
  Top 0.152: J8.B5 28.98,72.68 27.54,71.23 27.54,69.61 R11.1
N$4
  Top 0.152: J8.A5 31.98,72.02 32.74,71.26 R14.1
N$5  (via drill 0.35)
  Top 0.368: T2.3 44.07,37.74 | 44.07,37.74 43.86,37.74 v43.61,37.49 | 44.07,37.74 43.59,37.68 v43.61,37.49 | 44.07,37.74 43.76,37.37 v43.61,37.49
  Bottom 0.368: v43.61,37.49 43.61,36.97 | 43.61,36.97 43.61,31.85 U$4.P$1 | 43.61,36.97 43.79,37.42 v43.61,37.49 | 43.61,36.97 43.43,37.42 v43.61,37.49
N$7
  Top 0.152: D1.C R1.2
QSPI_SCLK
  Top 0.152: IC1.52 23.64,56.69 22.42,57.91 20.32,57.91 19.13,59.11 19.13,70.41 18.92,70.61 16.64,70.61 16.13,70.1 16.13,68.83 IC2.6
QSPI_SD0
  Top 0.152: IC1.53 23.24,56.67 22.43,57.48 19.96,57.48 18.54,58.9 18.54,68.45 18.14,68.86 17.58,68.86 IC2.5
QSPI_SD1
  Top 0.152: IC1.55 22.44,56.6 22.27,56.77 17.78,56.77 14.86,59.69 14.86,61.48 IC2.2
QSPI_SD2
  Top 0.152: IC1.54 22.84,56.63 22.4,57.07 18.41,57.07 16.13,59.36 16.13,61.48 IC2.3
QSPI_SD3
  Top 0.152: IC1.51 24.04,56.73 22.48,58.29 20.89,58.29 20.04,58.86 20.04,70.64 19.64,71.04 15.49,71.04 14.86,70.4 14.86,68.83 IC2.7
QSPI_SSN
  Top 0.152: IC1.56 22.04,56.39 16.65,56.39 13.62,59.41 | R8.1 11.41,62.76 12.62,61.55 IC2.1 13.62,61.51 13.62,59.41 | 13.62,59.41 12.91,60.12 9.28,60.12 R9.1
RADIO-DIO1  (via drill 0.35)
  Top 0.152: IC1.37 30.69,52.8 | 30.69,52.8 30.87,52.8 v31.14,52.53 | 35.57,45.65 36.22,46.3 36.22,50.67 37.13,51.59 62.81,51.59 70.48,43.92 U$2.DIO1 | 35.57,45.65 35.38,45.47 v35.38,45.16 | 30.69,52.8 30.86,52.4 v31.14,52.53 | 30.69,52.8 31.12,52.83 v31.14,52.53 | 35.57,45.65 35.21,45.41 v35.38,45.16 | 35.57,45.65 35.67,45.24 v35.38,45.16
  Bottom 0.152: v31.14,52.53 31.14,52 | 31.14,52 31.14,48.51 34.49,45.16 34.86,45.16 | 34.86,45.16 v35.38,45.16 | 31.14,52 31.39,52.35 v31.14,52.53 | 31.14,52 30.89,52.35 v31.14,52.53 | 34.86,45.16 35.21,44.91 v35.38,45.16 | 34.86,45.16 35.21,45.41 v35.38,45.16
RADIO_CS  (via drill 0.35)
  Top 0.152: IC1.41 28.16,54.47 28.61,54.47 29.36,55.22 29.5,55.22 | v30.02,55.17 29.97,55.22 29.5,55.22 | 60.97,72.7 60.57,72.3 42.89,72.3 32.69,62.1 | 60.97,72.7 v61.34,73.07 | v32.56,61.59 32.56,61.98 32.69,62.1 | v63.88,72.97 64.25,73.34 | 64.25,73.34 64.52,73.61 64.52,75.46 U$2.NSS | 29.5,55.22 29.83,54.94 v30.02,55.17 | 29.5,55.22 29.88,55.43 v30.02,55.17 | 32.69,62.1 32.37,61.82 v32.56,61.59 | 32.69,62.1 32.84,61.7 v32.56,61.59 | 60.97,72.7 61.39,72.78 v61.34,73.07 | 60.97,72.7 61.04,73.12 v61.34,73.07 | 64.25,73.34 63.83,73.27 v63.88,72.97 | 64.25,73.34 64.18,72.92 v63.88,72.97
  Bottom 0.152: 30.55,55.17 32.1,55.17 32.89,55.96 32.89,61.19 | 30.55,55.17 v30.02,55.17 | 32.89,61.19 32.89,61.27 v32.56,61.59 | v61.34,73.07 61.87,73.07 | 61.87,73.07 63.37,73.07 | 63.37,73.07 63.78,73.07 v63.88,72.97 | 30.55,55.17 30.2,55.41 v30.02,55.17 | 30.55,55.17 30.2,54.92 v30.02,55.17 | 32.89,61.19 32.86,61.62 v32.56,61.59 | 32.89,61.19 32.48,61.3 v32.56,61.59 | 61.87,73.07 61.51,73.32 v61.34,73.07 | 61.87,73.07 61.51,72.83 v61.34,73.07 | 63.37,73.07 63.66,72.76 v63.88,72.97 | 63.37,73.07 63.76,73.25 v63.88,72.97
RADIO_DIO0  (via drill 0.35)
  Top 0.152: IC1.36 29.54,52.4 | 29.54,52.4 29.81,52.4 v30.02,52.19 | U$2.DIO0 68.53,41.14 68.53,45.36 62.69,51.21 37.44,51.21 36.75,50.52 36.75,44.81 36.59,44.64 | v36.22,44.27 36.59,44.64 | 29.54,52.4 29.76,52.03 v30.02,52.19 | 29.54,52.4 29.96,52.48 v30.02,52.19 | 36.59,44.64 36.17,44.57 v36.22,44.27 | 36.59,44.64 36.52,44.22 v36.22,44.27
  Bottom 0.152: v30.02,52.19 30.39,51.82 | 30.39,51.82 30.58,51.63 30.58,48.54 34.85,44.27 35.69,44.27 | 35.69,44.27 v36.22,44.27 | 30.39,51.82 30.32,52.24 v30.02,52.19 | 30.39,51.82 29.97,51.89 v30.02,52.19 | 35.69,44.27 36.05,44.03 v36.22,44.27 | 35.69,44.27 36.05,44.52 v36.22,44.27
RADIO_MISO  (via drill 0.35)
  Top 0.152: U$1.7 51.27,74.17 51.27,73.44 50.88,73.06 | IC1.31 29.94,50.4 31.11,49.23 31.56,49.23 32.03,49.7 | 32.03,49.7 v32.4,50.07 | v34.67,54.56 34.67,55.08 | 34.67,55.08 34.67,62.1 43.78,71.22 50.58,71.22 | 64.4,71.48 64.13,71.22 51.63,71.22 | 64.4,71.48 64.71,71.79 | 64.71,71.79 v64.77,71.85 | 51.63,71.22 v51.1,71.22 | U$2.MISO 70.49,72.47 70.3,72.28 | v69.93,71.91 70.3,72.28 | 50.58,71.22 v51.1,71.22 | 50.88,73.06 50.87,73.05 v50.36,73.05 | 32.03,49.7 32.45,49.77 v32.4,50.07 | 32.03,49.7 32.1,50.12 v32.4,50.07 | 34.67,55.08 34.42,54.73 v34.67,54.56 | 34.67,55.08 34.92,54.73 v34.67,54.56 | 64.71,71.79 64.78,71.8 v64.77,71.85 | 64.4,71.48 64.47,71.9 v64.77,71.85 | 70.3,72.28 69.87,72.2 v69.93,71.91 | 70.3,72.28 70.22,71.86 v69.93,71.91 | 51.63,71.22 51.28,71.46 v51.1,71.22 | 51.63,71.22 51.28,70.97 v51.1,71.22 | 50.58,71.22 50.93,70.97 v51.1,71.22 | 50.58,71.22 50.93,71.46 v51.1,71.22 | 50.88,73.06 50.53,73.3 v50.36,73.05 | 50.88,73.06 50.54,72.8 v50.36,73.05
  Bottom 0.152: v32.4,50.07 32.93,50.07 | 32.93,50.07 33.18,50.07 34.67,51.56 34.67,54.03 | 34.67,54.03 34.67,54.22 | 34.67,54.22 v34.67,54.56 | v69.93,71.91 69.87,71.85 69.4,71.85 | 65.29,71.85 69.4,71.85 | v51.1,71.22 51.1,71.74 | 51.1,71.74 51.1,72.3 50.73,72.67 | 50.73,72.67 v50.36,73.05 | 32.93,50.07 32.58,50.32 v32.4,50.07 | 32.93,50.07 32.58,49.82 v32.4,50.07 | 34.67,54.22 34.83,54.45 v34.67,54.56 | 34.67,54.03 34.42,54.39 v34.67,54.56 | 65.29,71.85 64.94,72.1 v64.77,71.85 64.94,71.6 65.29,71.85 | 69.4,71.85 69.78,71.64 v69.93,71.91 | 69.4,71.85 69.73,72.13 v69.93,71.91 | 51.1,71.74 50.86,71.39 v51.1,71.22 | 51.1,71.74 51.35,71.39 v51.1,71.22 | 50.73,72.67 50.66,73.1 v50.36,73.05 | 50.73,72.67 50.31,72.75 v50.36,73.05
RADIO_MOSI  (via drill 0.35)
  Top 0.152: v32.77,49.23 32.39,48.85 | 32.39,48.85 32.14,48.6 31.01,48.6 29.61,50 IC1.30 | v64.77,70.94 64.4,70.57 | 64.4,70.57 64.26,70.43 47.01,70.43 | v46.48,70.43 45.96,70.43 | 45.96,70.43 43.79,70.43 35.33,61.98 35.33,54.45 | v35.33,53.92 35.33,54.14 | 35.33,54.14 35.33,54.45 | v68.45,71.2 68.48,71.22 68.48,71.72 | 68.48,71.72 U$2.MOSI | 47.01,70.43 v46.48,70.43 | v46.84,72.99 46.84,73.51 | 46.84,73.51 46.84,74.2 U$1.3 | 32.39,48.85 32.82,48.93 v32.77,49.23 | 32.39,48.85 32.47,49.28 v32.77,49.23 | 35.33,54.14 35.23,54 v35.33,53.92 | 35.33,54.45 35.58,54.1 v35.33,53.92 | 64.45,70.89 v64.77,70.94 | 64.4,70.57 64.45,70.89 | 64.45,70.89 64.47,70.99 v64.77,70.94 | 68.48,71.72 68.22,71.38 v68.45,71.2 | 68.48,71.72 68.71,71.36 v68.45,71.2 | 45.96,70.43 46.31,70.19 v46.48,70.43 | 45.96,70.43 46.31,70.68 v46.48,70.43 | 47.01,70.43 46.66,70.68 v46.48,70.43 | 47.01,70.43 46.66,70.19 v46.48,70.43 | 46.84,73.51 46.59,73.16 v46.84,72.99 | 46.84,73.51 47.08,73.16 v46.84,72.99
  Bottom 0.152: 33.29,49.24 35.33,51.28 35.33,53.4 | 33.29,49.24 33.27,49.23 v32.77,49.23 | v35.33,53.92 35.33,53.4 | v64.77,70.94 65.29,70.94 | 65.29,70.94 67.99,70.94 | 67.99,70.94 68.2,70.94 v68.45,71.2 | v46.48,70.43 46.48,70.96 | 46.48,70.96 46.48,72.6 | 46.48,72.6 46.48,72.63 v46.84,72.99 | 33.29,49.24 32.93,49.48 v32.77,49.23 | 33.29,49.24 32.95,48.98 v32.77,49.23 | 35.33,53.4 35.58,53.75 v35.33,53.92 | 35.33,53.4 35.08,53.75 v35.33,53.92 | 65.29,70.94 64.94,71.19 v64.77,70.94 | 65.29,70.94 64.94,70.7 v64.77,70.94 | 67.99,70.94 68.42,70.9 v68.45,71.2 | 67.99,70.94 68.18,71.33 v68.45,71.2 | 46.48,70.96 46.23,70.61 v46.48,70.43 | 46.48,70.96 46.73,70.61 v46.48,70.43 | 46.48,72.6 46.9,72.69 v46.84,72.99 | 46.48,72.6 46.54,73.03 v46.84,72.99
RADIO_RESET
  Top 0.152: IC1.40 28.11,54.02 29,54.02 29.54,54.56 33.78,54.56 34.19,54.96 34.19,60.53 34.02,60.7 34.02,62.38 34.02,62.48 34.02,62.61 43.36,71.96 61.72,71.96 62.48,72.72 U$2.RST
RADIO_SCK  (via drill 0.35)
  Top 0.152: IC1.29 29.48,49.6 30.87,48.21 32.75,48.21 | v33.27,48.21 32.75,48.21 | v35.94,52.98 35.94,53.51 | 35.94,53.51 35.94,61.62 43.61,69.29 47.89,69.29 | v48.41,69.29 48.94,69.29 | 48.94,69.29 65.02,69.29 66.48,70.75 U$2.SCK | 47.89,69.29 v48.41,69.29 | v49.1,72.91 49.07,72.94 49.07,73.43 | U$1.5 48.99,73.5 49.02,73.47 | 32.75,48.21 33.1,47.96 v33.27,48.21 | 32.75,48.21 33.1,48.46 v33.27,48.21 | 35.94,53.51 35.69,53.16 v35.94,52.98 | 35.94,53.51 36.19,53.16 v35.94,52.98 | 48.94,69.29 48.59,69.54 v48.41,69.29 | 48.94,69.29 48.59,69.04 v48.41,69.29 | 47.89,69.29 48.24,69.04 v48.41,69.29 | 47.89,69.29 48.24,69.54 v48.41,69.29 | 49.02,73.47 48.83,73.03 v49.1,72.91 | 49.02,73.47 49.07,73.43 | 49.07,73.43 49.34,73.17 v49.1,72.91
  Bottom 0.152: v33.27,48.21 33.64,48.58 | 33.64,48.58 35.86,50.8 35.86,52.47 | v35.94,52.98 35.86,52.91 35.86,52.47 | v48.41,69.29 48.41,69.82 | 48.41,69.82 48.41,72.3 48.73,72.62 | 48.82,72.63 v49.1,72.91 | 33.64,48.58 33.22,48.51 v33.27,48.21 | 33.64,48.58 33.57,48.16 v33.27,48.21 | 35.86,52.47 36.16,52.78 v35.94,52.98 | 35.86,52.47 35.67,52.85 v35.94,52.98 | 48.41,69.82 48.16,69.47 v48.41,69.29 | 48.41,69.82 48.66,69.47 v48.41,69.29 | 48.73,72.62 48.82,72.63 | 48.82,72.63 49.24,72.7 49.22,72.79 v49.1,72.91 | 48.73,72.62 48.79,72.97 v49.1,72.91
RUN
  Top 0.152: IC1.26 26.44,47.86 29.82,44.48 29.82,24.23 30.6,24.23 S2.1 S2.2
  Top 0.508: S2.2 34.56,24.09 34.56,22.33 34.02,21.79 R10.2
RX  (via drill 0.35)
  Top 0.152: IC1.3 11.88,54 10.54,52.65 10.54,21.34 24.56,7.32 32.04,7.32 | v32.56,7.32 32.04,7.32 | v32.33,5.18 31.96,4.81 | 31.96,4.81 31.83,4.67 J1.5 | 31.96,4.81 32.39,4.88 v32.33,5.18 | 31.96,4.81 32.04,5.23 v32.33,5.18 | 32.04,7.32 32.39,7.07 v32.56,7.32 | 32.04,7.32 32.39,7.56 v32.56,7.32
  Bottom 0.152: v32.56,7.32 32.56,6.79 | 32.56,6.79 32.56,5.65 | 32.56,5.65 32.56,5.41 v32.33,5.18 | 32.56,5.65 32.19,5.45 v32.33,5.18 | 32.56,5.65 32.63,5.23 v32.33,5.18 | 32.56,6.79 32.81,7.14 v32.56,7.32 | 32.56,6.79 32.32,7.14 v32.56,7.32
SCL
  Top 0.152: IC1.5 12.6,53.19 11.74,52.33 11.74,23.29 26.34,8.69 35.71,8.69 35.71,3.05 J1.11
SD_CS  (via drill 0.35)
  Top 0.152: IC1.14 21.19,44.71 16.56,40.08 16.56,28.65 28.75,16.46 33.05,16.46 | v33.58,16.46 33.05,16.46 | U$1.2 45.69,75.31 45.21,75.79 39.08,75.79 R13.2 37.3,74.76 36.68,74.14 36.68,66.77 31.88,61.97 | v39.7,16.51 39.33,16.88 | 39.33,16.88 36.3,19.91 36.3,27.86 35.18,28.98 35.18,43.04 | 35.18,43.04 v35.18,43.56 | v31.51,61.6 31.88,61.97 | 33.05,16.46 33.4,16.21 v33.58,16.46 | 33.05,16.46 33.4,16.71 v33.58,16.46 | 39.33,16.88 39.4,16.46 v39.7,16.51 | 39.33,16.88 39.75,16.81 v39.7,16.51 | 35.18,43.04 35.43,43.39 v35.18,43.56 | 35.18,43.04 34.93,43.39 v35.18,43.56 | 31.88,61.97 31.46,61.9 v31.51,61.6 | 31.88,61.97 31.81,61.55 v31.51,61.6
  Bottom 0.152: v39.7,16.51 39.5,16.31 39.22,16.31 | 39.22,16.31 34.08,16.31 | 34.08,16.31 33.73,16.31 v33.58,16.46 | v35.18,43.56 34.72,43.56 34.66,43.63 | 34.66,43.63 29.41,48.87 29.41,55.97 31.51,58.07 31.51,61.08 | 31.51,61.08 v31.51,61.6 | 34.08,16.31 33.82,16.65 v33.58,16.46 | 34.08,16.31 33.67,16.17 v33.58,16.46 | 39.22,16.31 39.64,16.22 v39.7,16.51 | 39.22,16.31 39.44,16.67 v39.7,16.51 | 34.66,43.63 34.98,43.34 v35.18,43.56 | 34.66,43.63 35.04,43.83 v35.18,43.56 | 31.51,61.08 31.76,61.43 v31.51,61.6 | 31.51,61.08 31.27,61.43 v31.51,61.6
SDA
  Top 0.152: IC1.4 12.25,53.6 11.15,52.5 11.15,22.02 25.02,8.15 33.22,8.15 34.37,7.01 J1.9
SWCLK  (via drill 0.35)
  Top 0.152: IC1.24 25.64,47.31 28.35,44.6 28.35,20.75 30.58,18.52 33.05,18.52 | 33.05,18.52 v33.58,18.52 | v41.19,17.54 41.33,17.68 41.7,17.68 | 41.7,17.68 46.28,17.68 46.67,18.07 | 46.67,18.07 v47.04,18.44 | v46.96,14.48 46.96,13.95 | 46.96,13.95 46.96,7.16 | 46.96,7.16 46.96,3.07 J1.29 | SWCLK.TP 46.96,7.16 | 33.05,18.52 33.4,18.27 v33.58,18.52 | 33.05,18.52 33.4,18.76 v33.58,18.52 | 41.7,17.68 41.3,17.83 v41.19,17.54 | 41.7,17.68 41.42,17.35 v41.19,17.54 | 46.67,18.07 47.09,18.14 v47.04,18.44 | 46.67,18.07 46.74,18.49 v47.04,18.44 | 46.96,13.95 47.21,14.3 v46.96,14.48 | 46.96,13.95 46.72,14.3 v46.96,14.48
  Bottom 0.152: v33.58,18.52 33.93,18.16 33.96,18.16 | 33.96,18.16 38.95,18.16 39.57,17.54 40.67,17.54 | v41.19,17.54 40.67,17.54 | v47.04,18.44 47.04,17.92 | 47.04,17.92 47.04,15 | 47.04,15 47.04,14.55 v46.96,14.48 | 33.96,18.16 33.87,18.58 v33.58,18.52 | 33.96,18.16 33.54,18.22 v33.58,18.52 | 40.67,17.54 41.02,17.3 v41.19,17.54 | 40.67,17.54 41.02,17.79 v41.19,17.54 | 47.04,17.92 47.29,18.27 v47.04,18.44 | 47.04,17.92 46.79,18.27 v47.04,18.44 | 47.04,15 46.74,14.69 v46.96,14.48 | 47.04,15 47.23,14.61 v46.96,14.48
SWDIO  (via drill 0.35)
  Top 0.152: IC1.25 26.11,48.67 26.11,47.45 29.06,44.5 29.06,21.21 30.84,19.43 33.05,19.43 | v33.58,19.43 33.05,19.43 | v45.85,18.44 45.32,18.44 | 45.32,18.44 40.81,18.44 | 40.81,18.44 v40.28,18.44 | v45.85,14.5 45.82,14.48 45.82,13.98 | 45.82,13.98 45.82,12.27 | J1.27 45.82,3 45.82,12.27 | SWDIO.TP 45.74,12.34 45.82,12.27 | 33.05,19.43 33.4,19.18 v33.58,19.43 | 33.05,19.43 33.4,19.68 v33.58,19.43 | 40.81,18.44 40.46,18.69 v40.28,18.44 | 40.81,18.44 40.46,18.19 v40.28,18.44 | 45.32,18.44 45.67,18.19 v45.85,18.44 | 45.32,18.44 45.67,18.69 v45.85,18.44 | 45.82,13.98 46.08,14.32 v45.85,14.5 | 45.82,13.98 45.59,14.34 v45.85,14.5
  Bottom 0.152: v33.58,19.43 34.1,19.43 | 34.1,19.43 35.1,19.43 35.84,18.69 39.82,18.69 | 39.82,18.69 40.03,18.69 v40.28,18.44 | v45.85,18.44 45.85,17.92 | 45.85,17.92 45.85,15.03 | 45.85,15.03 v45.85,14.5 | 34.1,19.43 33.75,19.68 v33.58,19.43 | 34.1,19.43 33.75,19.18 v33.58,19.43 | 39.82,18.69 40.01,18.31 v40.28,18.44 | 39.82,18.69 40.25,18.74 v40.28,18.44 | 45.85,17.92 46.09,18.27 v45.85,18.44 | 45.85,17.92 45.6,18.27 v45.85,18.44 | 45.85,15.03 45.6,14.68 v45.85,14.5 | 45.85,15.03 46.09,14.68 v45.85,14.5
TX
  Top 0.152: IC1.2 11.52,54.4 9.85,52.73 9.85,20.57 23.8,6.63 33.02,6.63 33.1,6.55 J1.7
USB_BOOT
  Top 0.152: S1.2 7.49,57.21 | 7.49,57.21 S1.1 | 7.35,58.72 7.37,58.7 11.56,58.7 TP4.TP | R9.2 7.35,58.72 | 7.35,58.72 7.35,57.35 7.49,57.21
USB_DM\
  Top 0.152: IC1.46 26.04,57.66 28.35,59.97 R7.2
USB_DP
  Top 0.152: IC1.47 25.64,58.45 26.8,59.61 R6.2
USB_N
  Top 0.152: R7.1 28.35,62.34 | 31.19,71.91 31.19,72.29 31.5,72.59 31.5,72.77 | 31.5,72.77 J8.B7 | 31.5,72.77 31.32,72.59 30.68,72.59 30.48,72.79 J8.A7
  Top 0.787: 28.35,62.34 28.35,63.86 31.19,66.7 31.19,71.91
USB_P
  Top 0.152: R6.1 26.8,62.32 | 30.25,71.91 30.25,72.31 29.98,72.58 J8.B6 29.98,74.31 30.17,74.5 30.84,74.5 30.99,74.35 J8.A6
  Top 0.787: 26.8,62.32 26.8,63.64 30.25,67.09 30.25,71.91
VBUS  (1 unrouted)
  Top 0.152: J8.VBUS2 28.28,73.06
XIN
  Top 0.152: IC1.20 24.09,48.7 24.09,44.13 22.39,42.43 C16.2 22.39,38.53 21.7,37.85 21.7,35.77 21.31,35.44 Y1.3
XOUT
  Top 0.152: IC1.21 24.44,48.62 24.43,48.62 24.43,42 R5.1

## Text on the board
tNames: BOOT | RESET | +3V3 | Antony Makar | +5v | PROVES OBC V1 | +3V3 | +5V | GND | +5V